# EAGLE design Power PCB_v10 (EAGLE 9.7.0)
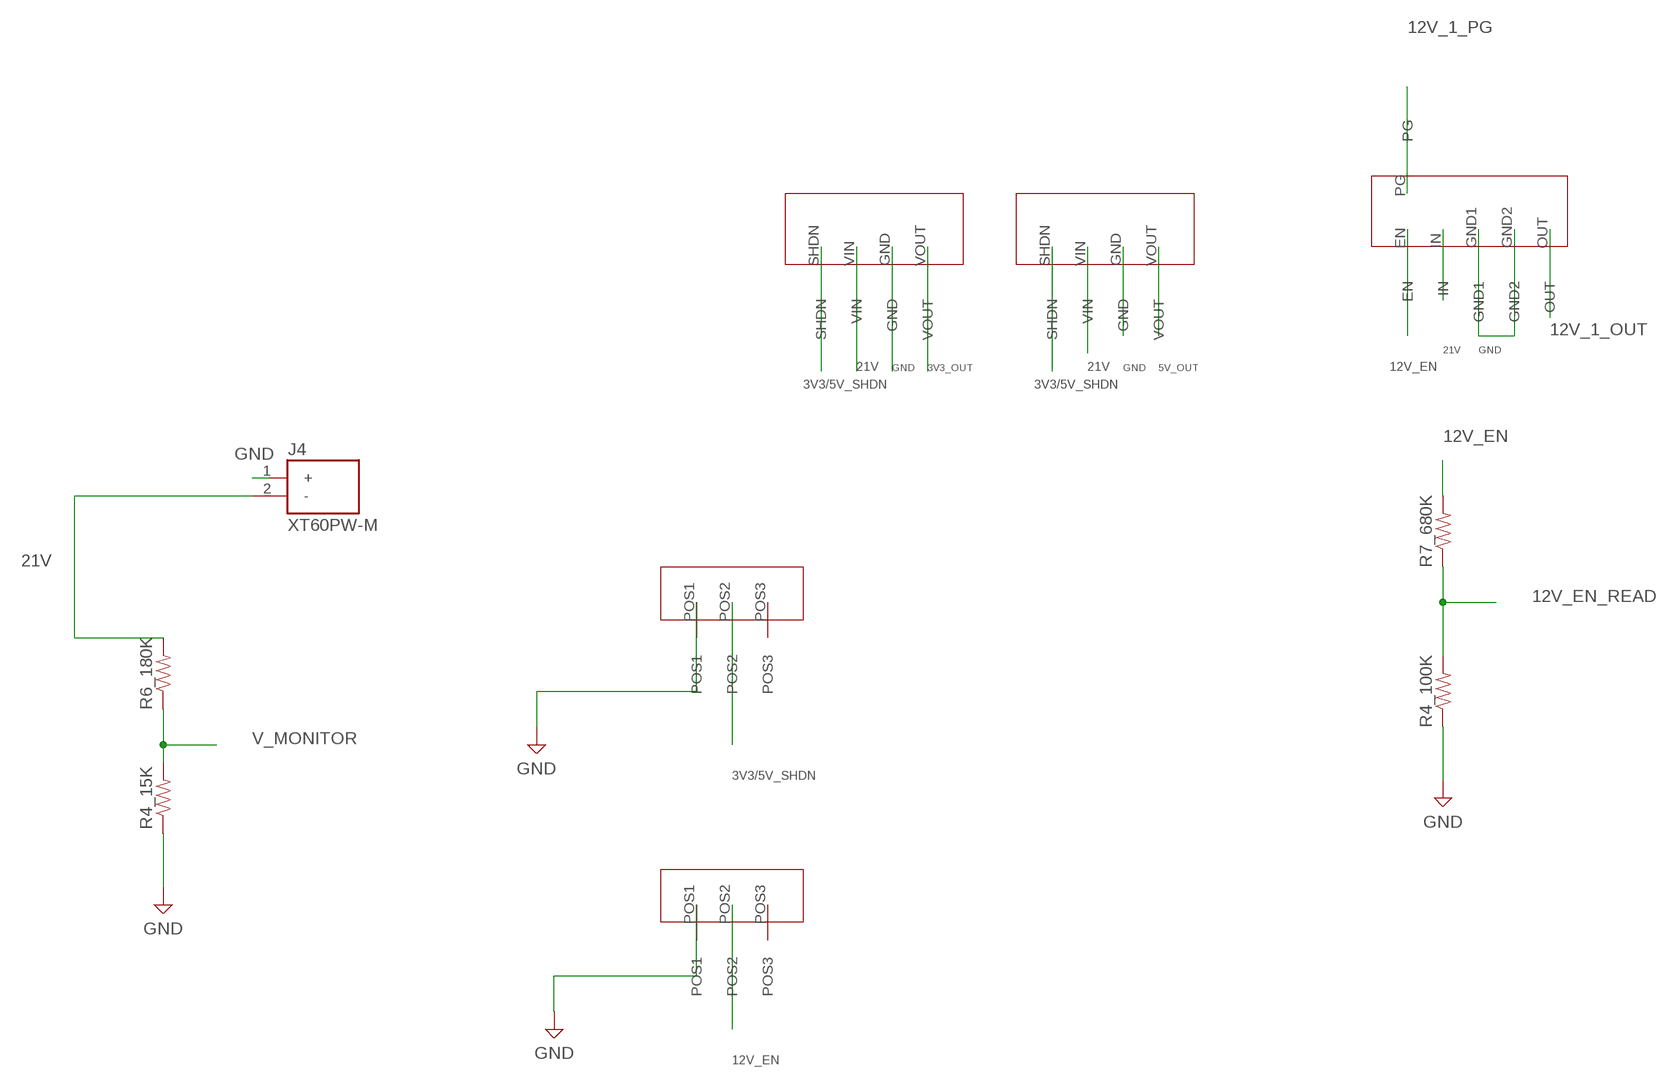
[diagram p0: schematic, sheet 1, part 1 of 2]
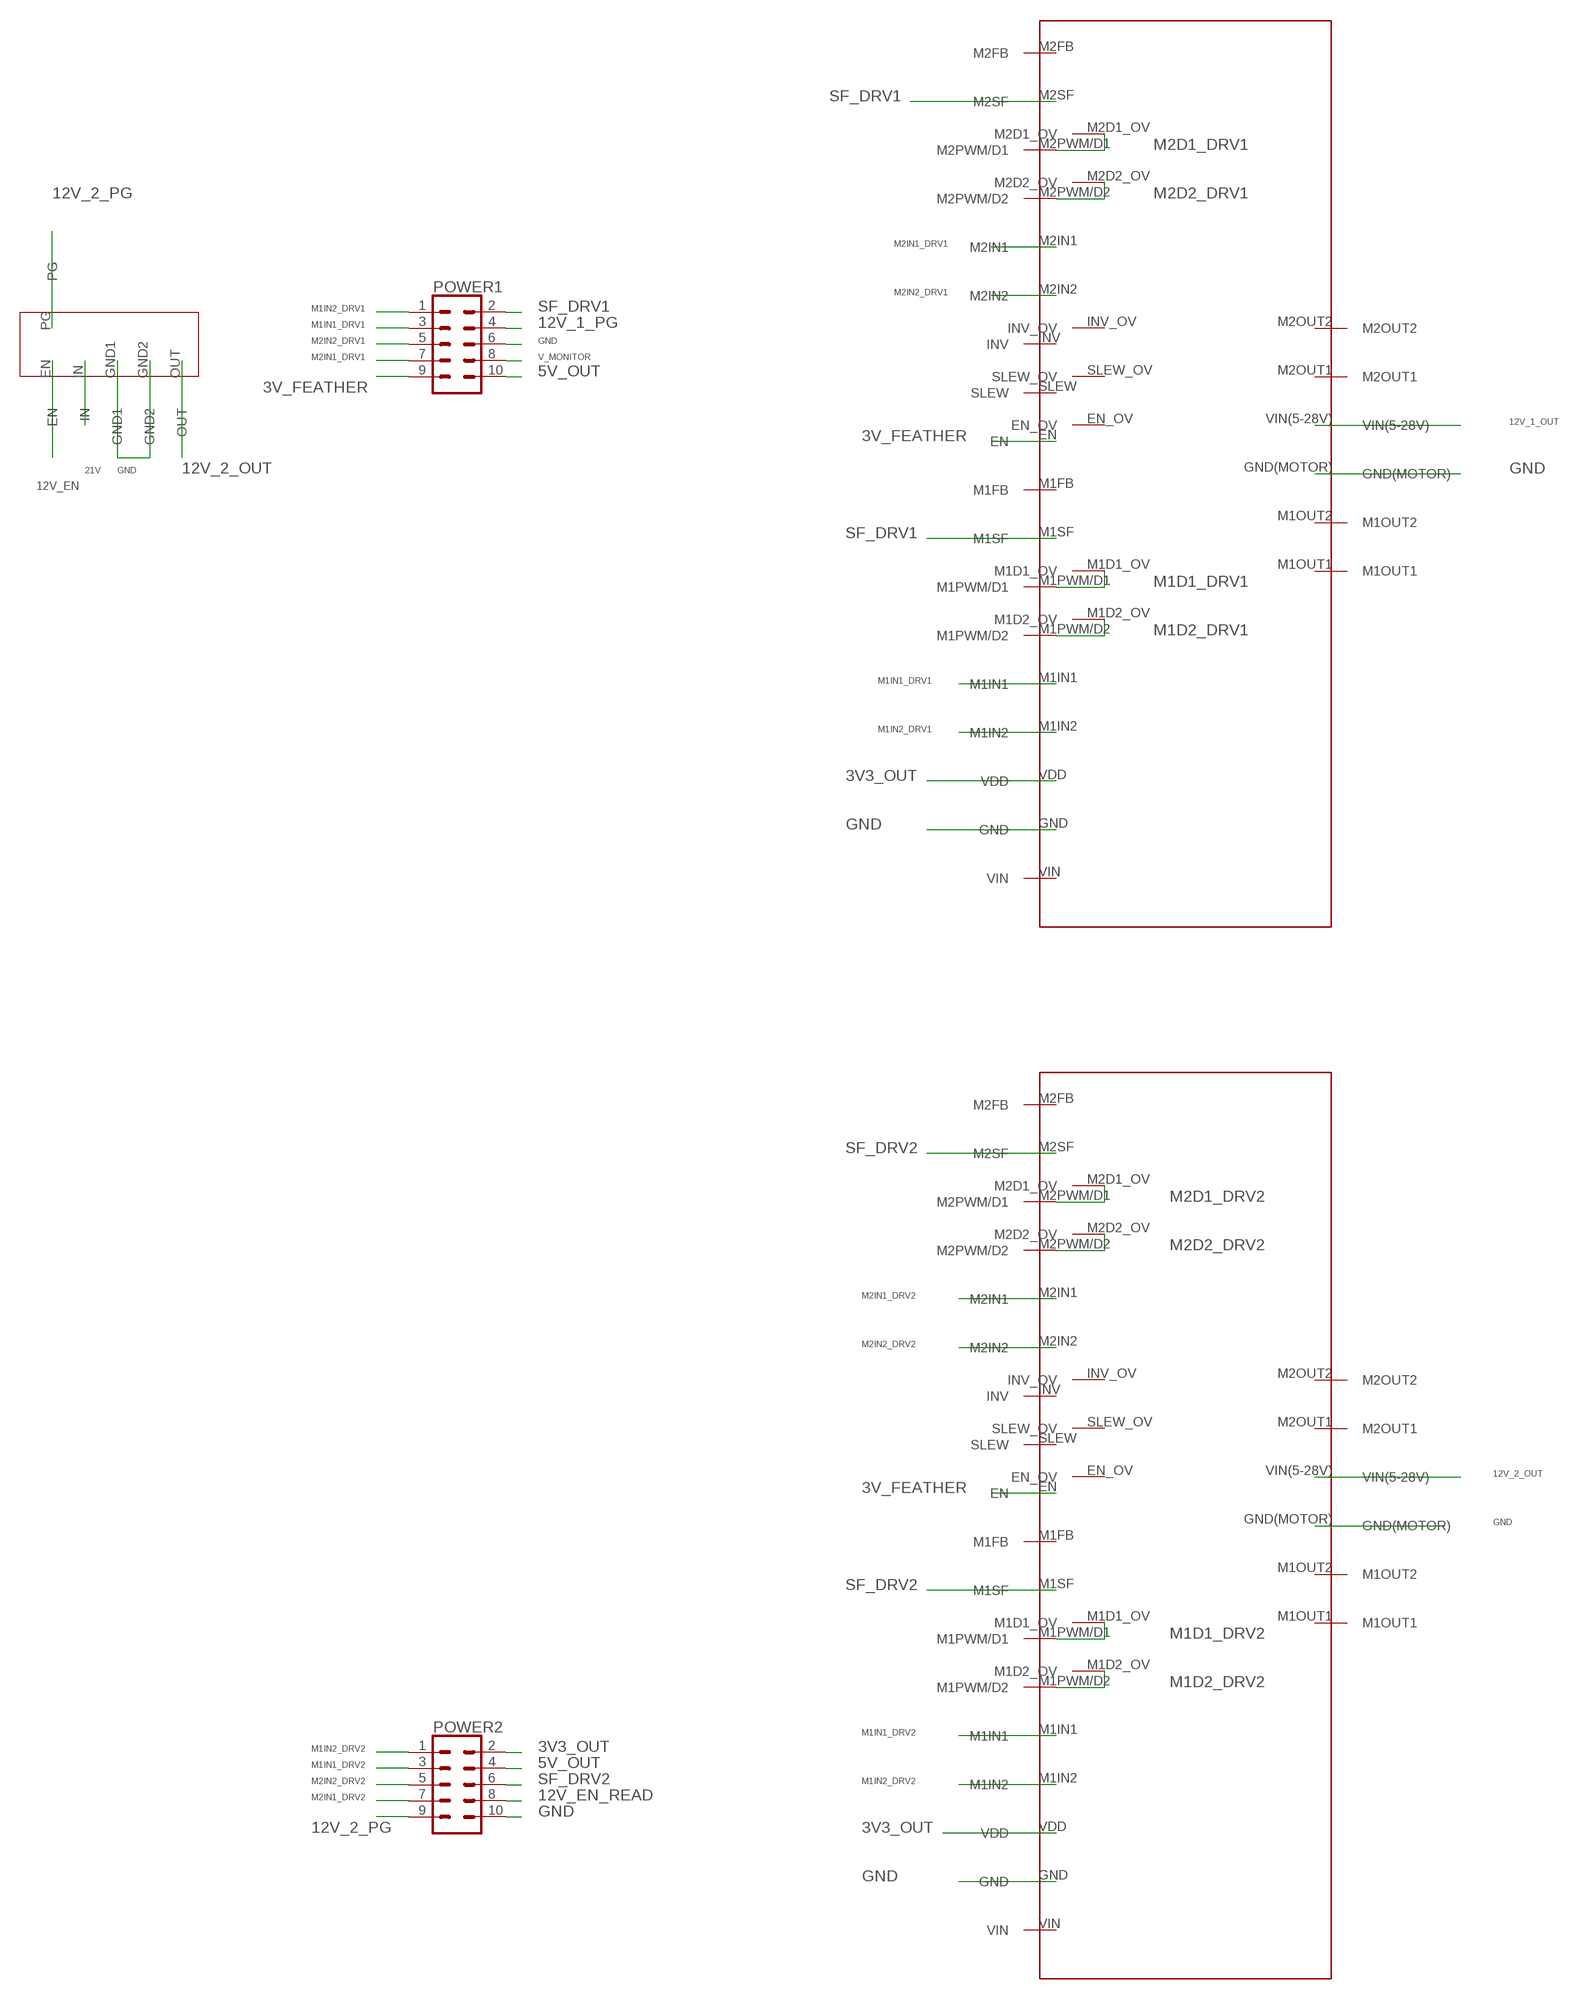
[diagram p1: schematic, sheet 1, part 2 of 2]

## Parts
J4  XT60PW-M  [AMASS_XT60PW-M]
POWER1  CONN_05X2SHD  [2X5-SHROUDED]
POWER2  CONN_05X2SHD  [2X5-SHROUDED]
R4_15K  RESISTORAXIAL-0.3  [AXIAL-0.3]
R4_100K  RESISTORAXIAL-0.3  [AXIAL-0.3]
R6_180K  RESISTORAXIAL-0.3  [AXIAL-0.3]
R7_680K  RESISTORAXIAL-0.3  [AXIAL-0.3]
U$1  CUSTOM_MOTORDRIVER  [CUSTOM_MOTORDRIVER]
U$2  CUSTOM_12V_REG  [CUSTOM_12V_REG]
U$3  CUSTOM_12V_REG  [CUSTOM_12V_REG]
U$4  CUSTOM_3.3/5V_REG  [CUSTOM_3.3/5V_REG]
U$5  CUSTOM_3.3/5V_REG  [CUSTOM_3.3/5V_REG]
U$6  CUSTOM_MOTORDRIVER  [CUSTOM_MOTORDRIVER]
U$7  CUSTOM_SWITCH  [CUSTOM_SWITCH]
U$8  CUSTOM_SWITCH  [CUSTOM_SWITCH]

## Nets
3V3/5V_SHDN: U$4.SHDN U$5.SHDN U$7.POS2
3V3_OUT: POWER2.2 U$1.VDD U$4.VOUT U$6.VDD
3V_FEATHER: POWER1.9 U$1.EN U$6.EN
5V_OUT: POWER1.10 POWER2.4 U$5.VOUT
12V_1_OUT: U$1.VIN(5-28V) U$3.OUT
12V_1_PG: POWER1.4 U$3.PG
12V_2_OUT: U$2.OUT U$6.VIN(5-28V)
12V_2_PG: POWER2.9 U$2.PG
12V_EN: R7_680K.P$2 U$2.EN U$3.EN U$8.POS2
12V_EN_READ: POWER2.8 R4_100K.P$2 R7_680K.P$1
21V: J4.2(-) R6_180K.P$2 U$2.IN U$3.IN U$4.VIN U$5.VIN
GND: J4.1(+) POWER1.6 POWER2.10 R4_15K.P$1 R4_100K.P$1 U$1.GND U$1.GND(MOTOR) U$2.GND1 U$2.GND2 U$3.GND1 U$3.GND2 U$4.GND U$5.GND U$6.GND U$6.GND(MOTOR) U$7.POS1 U$8.POS1
M1D1_DRV1: U$1.M1D1_OV U$1.M1PWM/D1
M1D1_DRV2: U$6.M1D1_OV U$6.M1PWM/D1
M1D2_DRV1: U$1.M1D2_OV U$1.M1PWM/D2
M1D2_DRV2: U$6.M1D2_OV U$6.M1PWM/D2
M1IN1_DRV1: POWER1.3 U$1.M1IN1
M1IN1_DRV2: POWER2.3 U$6.M1IN1
M1IN2_DRV1: POWER1.1 U$1.M1IN2
M1IN2_DRV2: POWER2.1 U$6.M1IN2
M2D1_DRV1: U$1.M2D1_OV U$1.M2PWM/D1
M2D1_DRV2: U$6.M2D1_OV U$6.M2PWM/D1
M2D2_DRV1: U$1.M2D2_OV U$1.M2PWM/D2
M2D2_DRV2: U$6.M2D2_OV U$6.M2PWM/D2
M2IN1_DRV1: POWER1.7 U$1.M2IN1
M2IN1_DRV2: POWER2.7 U$6.M2IN1
M2IN2_DRV1: POWER1.5 U$1.M2IN2
M2IN2_DRV2: POWER2.5 U$6.M2IN2
SF_DRV1: POWER1.2 U$1.M1SF U$1.M2SF
SF_DRV2: POWER2.6 U$6.M1SF U$6.M2SF
V_MONITOR: POWER1.8 R4_15K.P$2 R6_180K.P$1
Unconnected: U$1.EN_OV U$1.INV U$1.INV_OV U$1.M1FB U$1.M1OUT1 U$1.M1OUT2 U$1.M2FB U$1.M2OUT1 U$1.M2OUT2 U$1.SLEW U$1.SLEW_OV U$1.VIN U$6.EN_OV U$6.INV U$6.INV_OV U$6.M1FB U$6.M1OUT1 U$6.M1OUT2 U$6.M2FB U$6.M2OUT1 U$6.M2OUT2 U$6.SLEW U$6.SLEW_OV U$6.VIN U$7.POS3 U$8.POS3

## Library data of the parts
J4 = XT60PW-M:XT60PW-M: Check availability <https://pricing.snapeda.com/parts/XT60PW-M/AMASS/view-part?ref=eda>; AVAILABILITY: Not in stock; CHECK_PRICES: https://www.snapeda.com/parts/XT60PW-M/AMASS/view-part/?ref=eda; DESCRIPTION: Socket, DC supply, male, PIN: 2; MF: AMASS; MP: XT60PW-M; PACKAGE: Package; PRICE: None; SNAPEDA_LINK: https://www.snapeda.com/parts/XT60PW-M/AMASS/view-part/?ref=snap
POWER1 POWER2 = SparkFun-Connectors:CONN_05X2: Multi connection point. Often used as Generic Header-pin footprint for 0.1 inch spaced/style header connections For AVR SPI programming port, see special device with nice symbol: "AVR_SPI_PROG_5x2.dev" You can populate with any combo of single row headers, but if you'd like an exact match, check these: 2x5 AVR ICSP Male Header <https://www.sparkfun.com/products/778> (PRT-00778) 2x5 Pin Shrouded Header <https://www.sparkfun.com/products/8506> (PRT-08506) On any of the 0.1 inch spaced packages, you can populate with these: Break Away Headers - Straight <https://www.sparkfun.com/products/116> (PRT-00116) Break Away Male Headers - Right Angle <https://www.sparkfun.com/products/553> (PRT-00553) Female Headers <https://www.sparkfun.com/products/115> (PRT-00115) Break Away Headers - Machine Pin <https://www.sparkfun.com/products/117> (PRT-00117) Break Away Female Headers - Swiss Machine Pin <https://www.sparkfun.com/products/743> (PRT-00743) Special note: the shrouded connector mates well with our 5x2 ribbon cables: 2x5 Pin IDC Ribbon Cable <https://www.sparkfun.com/products/8535> (PRT-08535); PROD_ID: CONN-08671; SF_ID: PRT-08506
R4_15K R4_100K R6_180K R7_680K = SparkFun-Resistors:RESISTOR: Generic Resistor Package
U$1 U$6 = Custom_MotorDriver:CUSTOM_MOTORDRIVER
U$2 U$3 = Footprint Complete:CUSTOM_12V_REG
U$4 U$5 = Custom_3.3/5V_Reg:CUSTOM_3.3/5V_REG
U$7 U$8 = Custom_Switch:CUSTOM_SWITCH

## Board
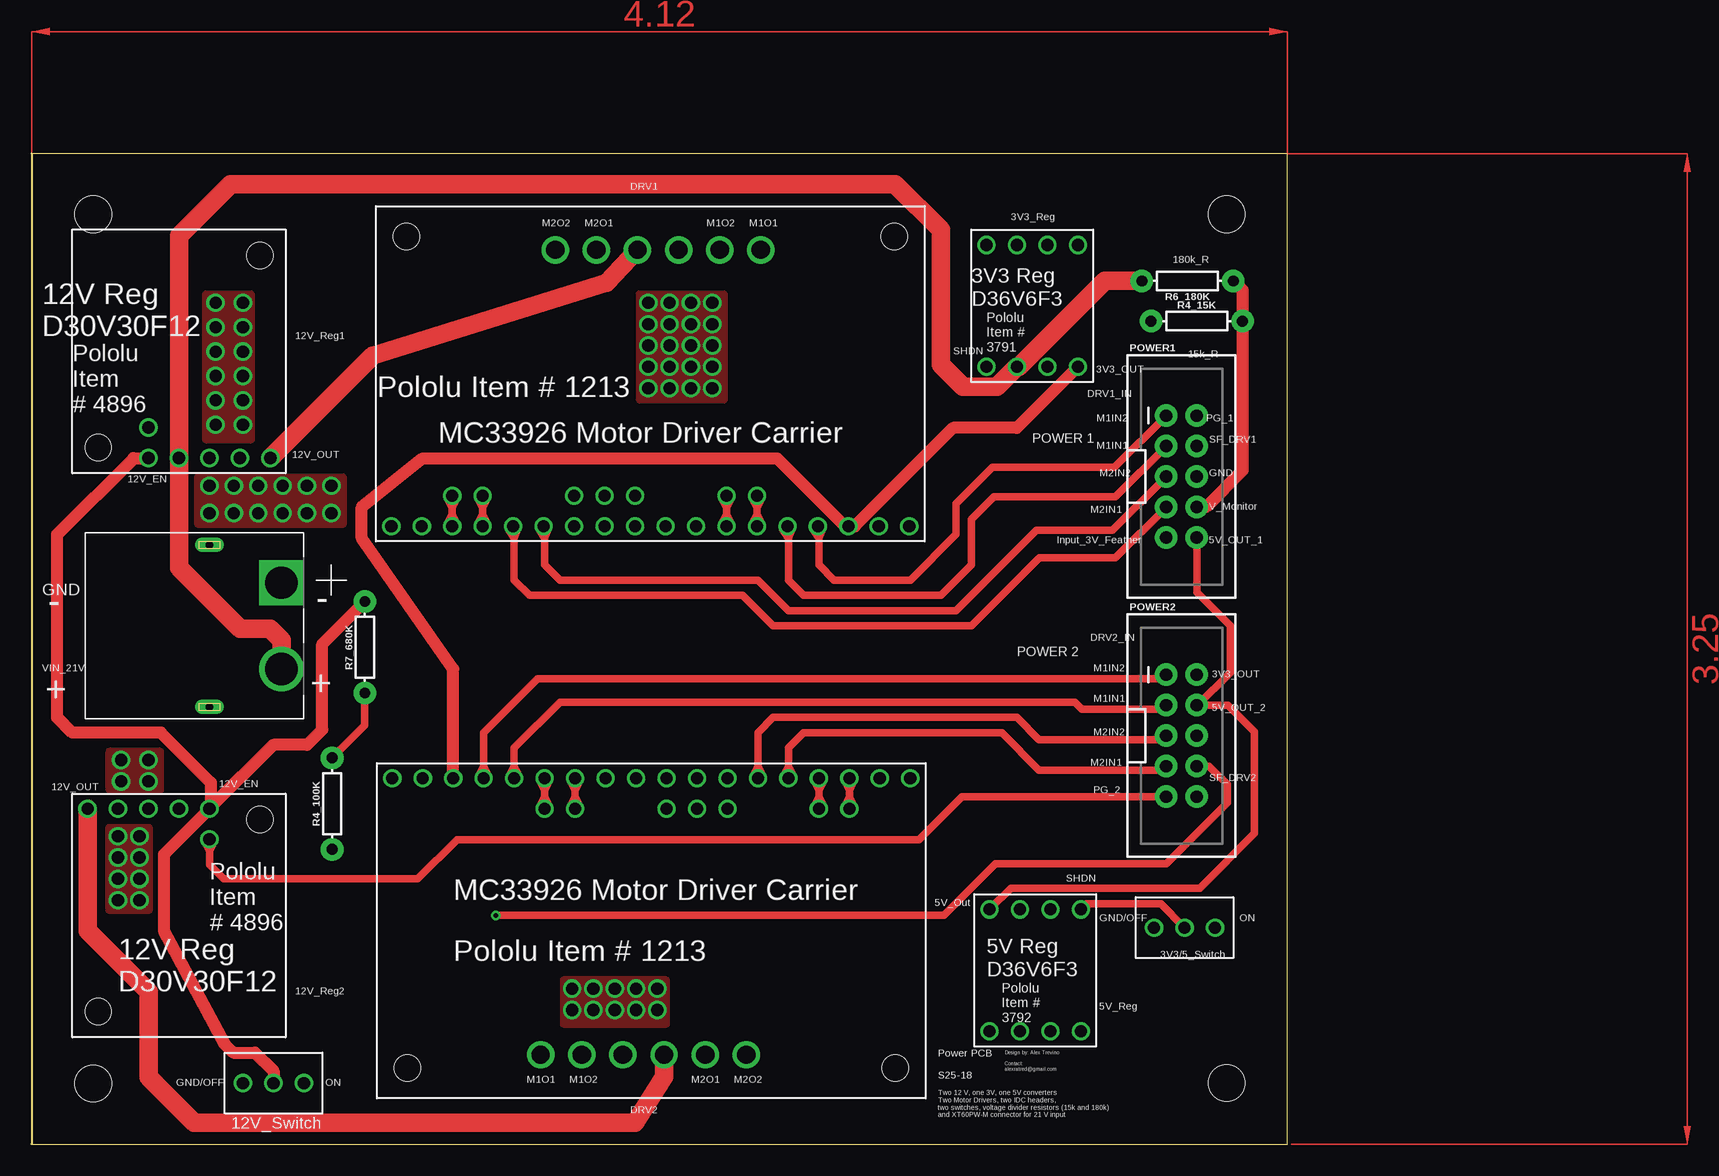
[diagram p2: board, top side]
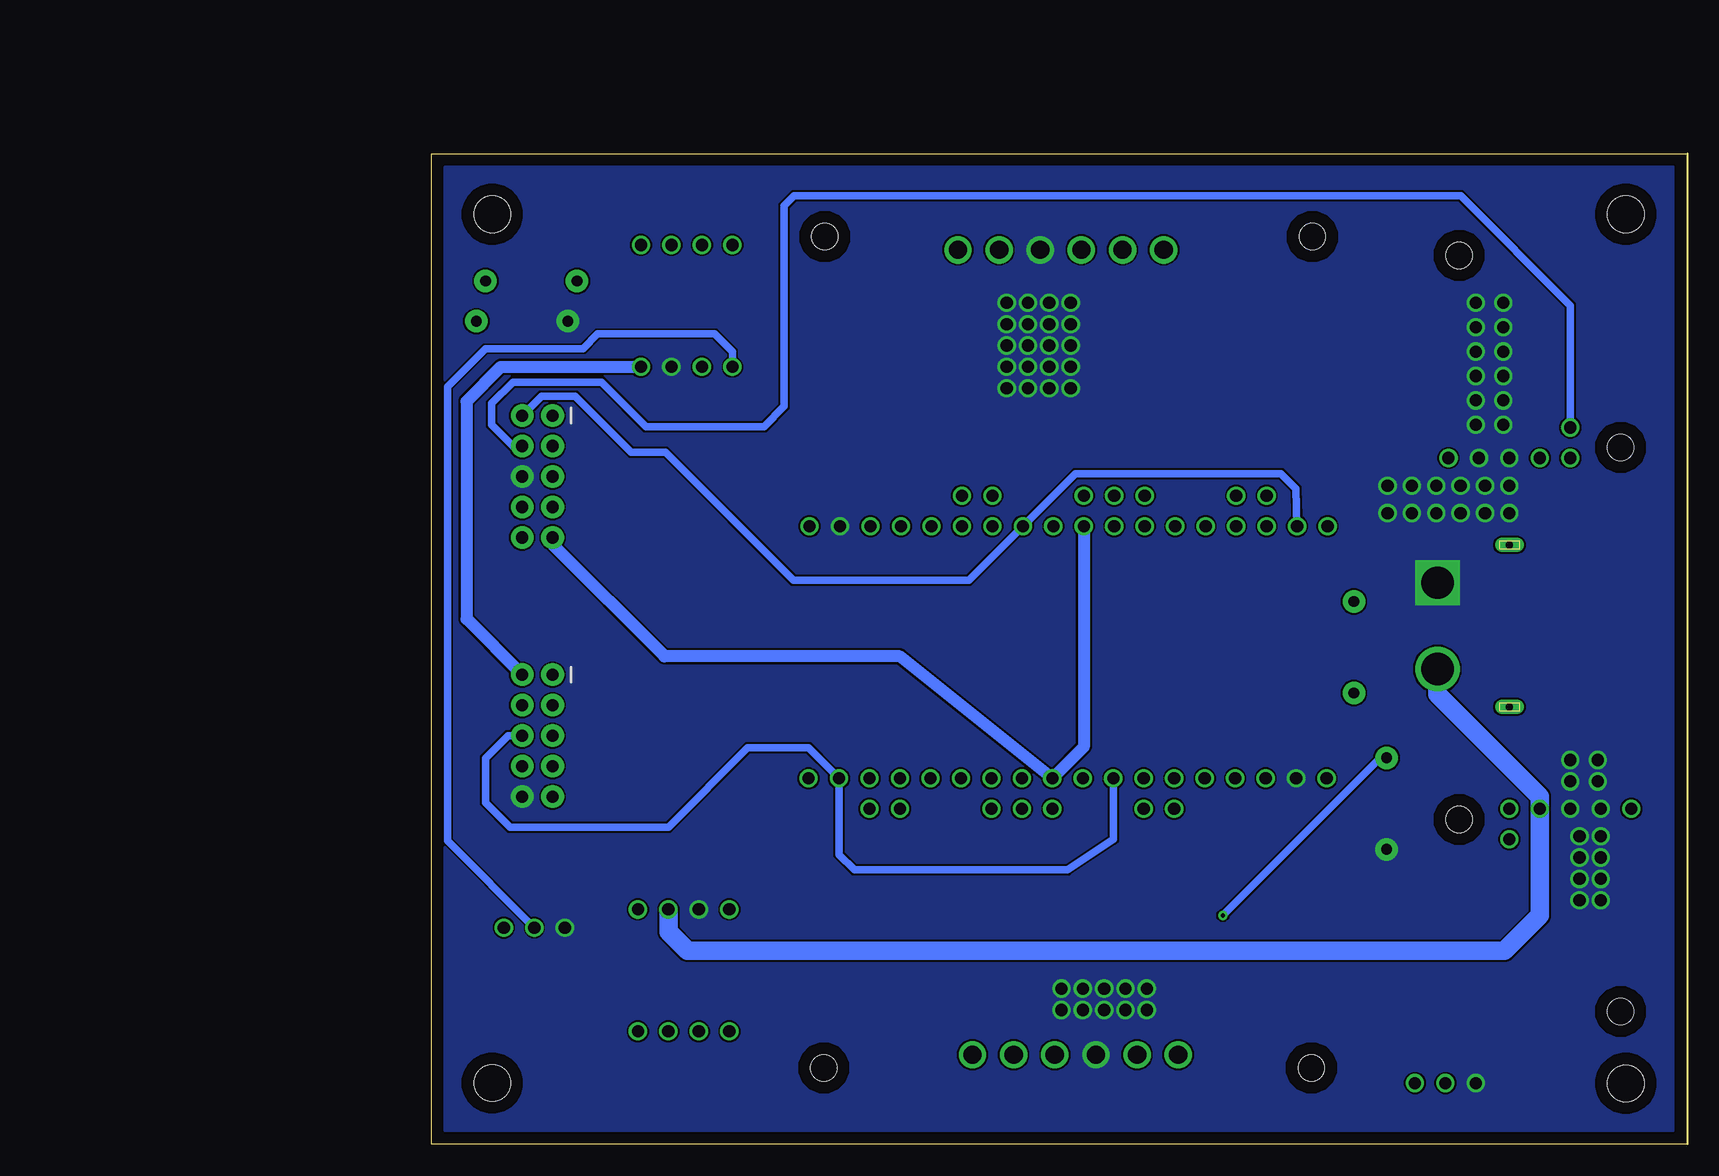
[diagram p3: board, bottom side, seen from below]

Size 104.67 x 82.54 mm. Coordinates in mm from the lower left corner, seen from the top.
Outline: 0,0 104.67,0 104.67,82.54 0,82.54 0,0
Copper layers (1*16): Top / Bottom
Stack-up Default Layer Stack: Top User Defined 0.035mm / Dielectric-1 User Defined 1.5mm / Bottom User Defined 0.035mm
Design rules: minimum copper width 6mil, minimum drill size 0.35mm, copper clearance wire_polygon to wire_polygon 6mil, copper clearance wire_polygon to pad_smd 6mil, copper clearance wire_polygon to via 6mil, copper clearance pad_smd to pad_smd 6mil, copper clearance pad_smd to via 6mil, copper clearance via to via 6mil, copper clearance smd to pad (same net) 6mil, copper clearance smd to via (same net) 6mil, copper clearance smd to smd (same net) 6mil, dimension clearance 40mil, via restrict clearance 0mil, restrict clearance 0mil, drill distance 6mil, keepout clearance 0mil
Holes 3.05 mm at 99.61,77.48 5.13,77.48 5.13,5.06 99.61,5.09

### Footprints (pad centres in the part's own frame; a part is rotated, then mirrored left to right if it is on the bottom)
AMASS_XT60PW-M = drill 2.7 square: 1 3.6,-6 | drill 2.7: 2 -3.6,-6 | drill 0.6 pad 1.2 long: S1 6.75,0; S2 -6.75,0
2X5-SHROUDED = drill 1.016 pad 1.88: 1 -1.27,5.08; 2 1.27,5.08; 3 -1.27,2.54; 4 1.27,2.54; 5 -1.27,0; 6 1.27,0; 7 -1.27,-2.54; 8 1.27,-2.54; 9 -1.27,-5.08; 10 1.27,-5.08
AXIAL-0.3 = drill 0.9 pad 1.88: P$1 -3.81,0; P$2 3.81,0
CUSTOM_MOTORDRIVER = drill 1.016: EN 21.59,1.27; EN_OV 21.59,3.81; GND 41.91,1.27; INV 16.51,1.27; INV_OV 16.51,3.81; M1D1_OV 29.21,3.81; M1D2_OV 31.75,3.81; M1FB 24.13,1.27; M1IN1 34.29,1.27; M1IN2 36.83,1.27; M1PWM/D1 29.21,1.27; M1PWM/D2 31.75,1.27; M1SF 26.67,1.27; M2D1_OV 6.35,3.81; M2D2_OV 8.89,3.81; M2FB 1.27,1.27; M2IN1 11.43,1.27; M2IN2 13.97,1.27; M2PWM/D1 6.35,1.27; M2PWM/D2 8.89,1.27; M2SF 3.81,1.27; SLEW 19.05,1.27; SLEW_OV 19.05,3.81; VDD 39.37,1.27; VIN 44.45,1.27 | drill 1.524: GND(MOTOR) 25.222,24.308; M1OUT1 32.08,24.308; M1OUT2 28.651,24.308; M2OUT1 18.364,24.308; M2OUT2 14.935,24.308; VIN(5-28V) 21.793,24.308 | hole 2.184: 2.54,25.4; 43.18,25.4
CUSTOM_12V_REG = drill 1.016: EN 6.35,1.27; GND1 11.43,1.27; GND2 13.97,1.27; IN 8.89,1.27; OUT 16.51,1.27; PG 6.35,3.81 | hole 2.184: 2.159,2.159; 15.621,18.161
CUSTOM_3.3/5V_REG = drill 1.016: GND 6.35,1.27; SHDN 1.27,1.27; STND_1 1.27,11.43; STND_2 3.81,11.43; STND_3 6.35,11.43; STND_4 8.89,11.43; VIN 3.81,1.27; VOUT 8.89,1.27
CUSTOM_SWITCH = drill 1.016: POS1 1.524,2.54; POS2 4.064,2.54; POS3 6.604,2.54

### Placement (x,y rotation side)
J4  14.83,43.18 90 top
POWER1  95.86,55.63 0 top
POWER2  95.86,34.04 0 top
R4_15K  97.13,68.58 0 top
R4_100K  25.06,28.37 90 top
R6_180K  96.36,71.93 180 top
R7_680K  27.78,41.4 90 top
U$1  28.72,50.22 0 top
U$2  21.18,29.21 180 top
U$3  3.4,55.9 0 top
U$4  78.33,63.5 0 top
U$5  88.74,20.83 180 top
U$6  74.52,31.75 180 top
U$7  92.05,15.49 0 top
U$8  16.1,2.54 0 top

### Tracks (layer width: path | path; a pad name or v marks a point on that pad's centre or on a via)
3V3/5V_SHDN
  Top 0.61: U$5.SHDN 87.93,20.02 94.13,20.02 U$7.POS2
  Bottom 0.61: U$4.SHDN 79.6,66.04 81.08,67.52 90.82,67.52 92.05,66.29 100.17,66.29 103.35,63.12 103.35,25.27 U$7.POS2
3V3_OUT
  Top 1.016: U$4.VOUT 82.14,59.69 76.82,59.69 68.62,51.49 U$1.VDD 67.81,51.49 62.14,57.15 32.61,57.15 27.53,53.09 27.53,50.47 35.15,39.59 U$6.VDD
  Bottom 1.016: U$4.VOUT 98.9,64.77 101.77,61.9 101.77,43.76 POWER2.2
3V_FEATHER
  Bottom 1.016: U$1.EN 50.31,33.1 U$6.EN 65.63,40.64 85.26,40.64 94.59,49.96 POWER1.9
5V_OUT
  Top 0.61: POWER1.10 97.13,45.97 99.92,43.18 99.92,39.29 97.2,36.58 | 97.2,36.58 POWER2.4 | 97.2,36.58 99.72,36.58 101.95,34.34 101.95,25.91 97.38,21.34 81.63,21.34 U$5.VOUT
12V_1_OUT
  Top 1.524: U$3.OUT 28.44,65.7 47.95,71.77 U$1.VIN(5-28V)
12V_1_PG
  Bottom 0.61: U$3.PG 9.75,69.87 18.89,79.02 74.45,79.02 75.28,78.18 75.28,61.47 76.96,59.79 86.81,59.79 90.52,63.5 97.89,63.5 99.67,61.72 99.67,59.94 97.89,58.17 POWER1.4
12V_2_OUT
  Top 1.524: U$2.OUT 4.67,17.78 9.75,12.7 9.75,5.59 13.56,1.78 50.3,1.78 52.73,5.59 U$6.VIN(5-28V)
12V_2_PG
  Top 0.61: U$2.PG 14.83,24.38 | 14.83,24.38 14.83,23.3 16.03,22.09 32.2,22.09 35.47,25.37 73.98,25.37 77.57,28.96 POWER2.9 | 14.83,24.38 15.24,25.19 | 15.24,25.19 | U$2.PG 15.24,25.19 | 14.83,24.38 14.42,25.19 | U$2.PG 14.42,25.19 | 14.83,24.38 15.24,25.19 | U$2.PG 15.24,25.19 | 14.83,24.38 14.42,25.19 | U$2.PG 14.42,25.19
12V_EN
  Top 1.016: U$3.EN 8.5,57.17 2.13,50.8 2.13,35.56 3.4,34.29 10.78,34.29 14.94,30.13 14.94,28.05 | R7_680K.P$2 24.23,41.66 24.23,34.54 22.96,33.27 20.16,33.27 14.94,28.05 | 14.94,28.05 U$2.EN 11.02,24.13 11.02,17.78 16.1,8.33 16.81,7.62 18.64,7.62 20.16,6.1 U$8.POS2
12V_EN_READ  (via drill 0.35)
  Top 0.61: R4_100K.P$2 27.78,34.91 R7_680K.P$1 | POWER2.8 98.14,31.5 99.67,29.97 99.67,28.45 94.59,23.37 80.36,23.37 76.04,19.05 v38.71,19.05
  Bottom 0.61: v38.71,19.05 25.57,32.18 R4_100K.P$2
21V
  Top 1.524: R6_180K.P$2 89.47,71.93 82.31,64.77 U$4.VIN 80.46,63.09 77.64,63.09 75.79,64.94 75.79,76.2 71.99,80 16.61,80 12.29,75.68 U$3.IN 12.29,48.03 17.39,42.93 19.91,42.93 20.83,42.01 J4.2
  Bottom 1.524: U$5.VIN 84.93,17.7 83.34,16.1 15.24,16.1 12.29,19.05 U$2.IN 12.29,28.96 20.83,37.5 J4.2
GND  (via drill 1.02)
  other vias: 15.34,70.1 17.62,70.1 15.34,68.07 17.62,68.07 15.34,66.04 17.62,66.04 15.34,64.01 17.62,64.01 15.34,61.98 17.62,61.98 15.34,59.94 17.62,59.94 51.41,70.1 53.18,70.1 54.96,70.1 56.74,70.1 51.41,68.33 53.18,68.33 54.96,68.33 56.74,68.33 51.41,66.55 53.18,66.55 54.96,66.55 56.74,66.55 51.41,64.77 53.18,64.77 54.96,64.77 56.74,64.77 51.41,62.99 53.18,62.99 54.96,62.99 56.74,62.99 7.46,32 9.75,32 9.75,30.23 7.46,30.23 7.21,25.65 8.99,25.65 7.21,23.88 8.99,23.88 7.21,22.1 8.99,22.1 7.21,20.32 8.99,20.32 45.06,12.95 46.83,12.95 48.61,12.95 50.39,12.95 52.17,12.95 45.06,11.18 46.83,11.18 48.61,11.18 50.39,11.18 52.17,11.18 14.83,54.86 16.86,54.86 18.89,54.86 20.93,54.86 22.96,54.86 24.99,54.86 14.83,52.58 16.86,52.58 18.89,52.58 20.93,52.58 22.96,52.58 24.99,52.58
  pour Bottom (no thermals): -1.68,85.09 106.27,85.09 106.27,-2.54 -1.68,-2.54
  pour Top: 13.56,55.88 26.26,55.88 26.26,51.37 13.56,51.37
  pour Top: 14.23,71.12 18.6,71.12 18.6,58.42 14.23,58.42
  pour Top: 50.39,71.12 58.01,71.12 58.01,61.72 50.39,61.72
  pour Top: 6.17,26.67 10.09,26.67 10.09,19.21 6.17,19.21
  pour Top: 44.04,13.97 53.18,13.97 53.18,9.71 44.04,9.71
  pour Top: 6.19,33.02 11.02,33.02 11.02,29.21 6.19,29.21
M1D1_DRV1
  Top 0.61: U$1.M1D1_OV 57.93,53.01 | 57.93,53.01 57.93,52.5 | 57.93,52.5 U$1.M1PWM/D1 | 57.93,52.5 | 57.93,52.5 | 57.93,52.5 58.34,51.69 | 57.93,52.5 57.52,51.69 | 57.52,51.69 | U$1.M1PWM/D1 57.52,51.69 | 57.93,52.5 58.34,51.69 | U$1.M1PWM/D1 58.34,51.69 | 57.93,52.5 57.52,51.69 | U$1.M1PWM/D1 57.52,51.69 | 57.93,52.5 58.34,51.69 | U$1.M1PWM/D1 58.34,51.69 | 57.93,53.01 58.34,53.82 | 58.34,53.82 | U$1.M1D1_OV 58.34,53.82 | 57.93,53.01 57.52,53.82 | U$1.M1D1_OV 57.52,53.82 | 57.93,53.01 58.34,53.82 | U$1.M1D1_OV 58.34,53.82 | 57.93,53.01 57.52,53.82 | U$1.M1D1_OV 57.52,53.82
M1D1_DRV2
  Top 0.61: U$6.M1PWM/D1 45.31,29.46 | 45.31,29.46 45.31,28.96 | 45.31,28.96 U$6.M1D1_OV | 45.31,29.46 45.72,30.27 | 45.72,30.27 | U$6.M1PWM/D1 45.72,30.27 | 45.31,29.46 44.9,30.27 | U$6.M1PWM/D1 44.9,30.27 | 45.31,29.46 45.72,30.27 | U$6.M1PWM/D1 45.72,30.27 | 45.31,29.46 44.9,30.27 | U$6.M1PWM/D1 44.9,30.27 | 45.31,28.96 | 45.31,28.96 | 45.31,28.96 45.72,28.15 | 45.31,28.96 44.9,28.15 | 44.9,28.15 | U$6.M1D1_OV 44.9,28.15 | 45.31,28.96 45.72,28.15 | U$6.M1D1_OV 45.72,28.15 | 45.31,28.96 44.9,28.15 | U$6.M1D1_OV 44.9,28.15 | 45.31,28.96 45.72,28.15 | U$6.M1D1_OV 45.72,28.15
M1D2_DRV1
  Top 0.61: U$1.M1D2_OV 60.47,53.01 | 60.47,53.01 60.47,52.5 | 60.47,52.5 U$1.M1PWM/D2 | 60.47,52.5 | 60.47,52.5 | 60.47,52.5 60.88,51.69 | 60.47,52.5 60.06,51.69 | 60.06,51.69 | U$1.M1PWM/D2 60.06,51.69 | 60.47,52.5 60.88,51.69 | U$1.M1PWM/D2 60.88,51.69 | 60.47,52.5 60.06,51.69 | U$1.M1PWM/D2 60.06,51.69 | 60.47,52.5 60.88,51.69 | U$1.M1PWM/D2 60.88,51.69 | 60.47,53.01 60.88,53.82 | 60.88,53.82 | U$1.M1D2_OV 60.88,53.82 | 60.47,53.01 60.06,53.82 | U$1.M1D2_OV 60.06,53.82 | 60.47,53.01 60.88,53.82 | U$1.M1D2_OV 60.88,53.82 | 60.47,53.01 60.06,53.82 | U$1.M1D2_OV 60.06,53.82
M1D2_DRV2
  Top 0.61: U$6.M1PWM/D2 42.77,29.46 | 42.77,29.46 42.77,28.96 | 42.77,28.96 U$6.M1D2_OV | 42.77,29.46 43.18,30.27 | 43.18,30.27 | U$6.M1PWM/D2 43.18,30.27 | 42.77,29.46 42.36,30.27 | U$6.M1PWM/D2 42.36,30.27 | 42.77,29.46 43.18,30.27 | U$6.M1PWM/D2 43.18,30.27 | 42.77,29.46 42.36,30.27 | U$6.M1PWM/D2 42.36,30.27 | 42.77,28.96 | 42.77,28.96 | 42.77,28.96 43.18,28.15 | 42.77,28.96 42.36,28.15 | 42.36,28.15 | U$6.M1D2_OV 42.36,28.15 | 42.77,28.96 43.18,28.15 | U$6.M1D2_OV 43.18,28.15 | 42.77,28.96 42.36,28.15 | U$6.M1D2_OV 42.36,28.15 | 42.77,28.96 43.18,28.15 | U$6.M1D2_OV 43.18,28.15
M1IN1_DRV1
  Top 0.61: U$1.M1IN1 63.09,51.4 63.09,50.47 | 63.09,50.47 63.09,46.99 64.36,45.72 75.79,45.72 78.33,48.26 78.33,52.07 80.2,53.94 90.36,53.94 POWER1.3 | 63.09,50.47 63.43,51.31 U$1.M1IN1 | 63.09,50.47 62.62,51.25 U$1.M1IN1
M1IN1_DRV2
  Top 0.61: U$6.M1IN1 40.23,31.5 | 40.23,31.5 40.23,33.02 44.04,36.83 86.97,36.83 87.55,36.25 94.26,36.25 POWER2.3 | 40.23,31.5 | 40.23,31.5 | 40.23,31.5 40.64,30.69 | 40.23,31.5 39.82,30.69 | 39.82,30.69 | U$6.M1IN1 39.82,30.69 | 40.23,31.5 40.64,30.69 | U$6.M1IN1 40.64,30.69 | 40.23,31.5 39.82,30.69 | U$6.M1IN1 39.82,30.69 | 40.23,31.5 40.64,30.69 | U$6.M1IN1 40.64,30.69
M1IN2_DRV1
  Top 0.61: U$1.M1IN2 65.63,51.4 65.63,50.47 | 65.63,50.47 65.63,48.26 66.9,46.99 73.25,46.99 77.06,50.8 77.06,53.34 80.11,56.39 90.27,56.39 POWER1.1 | 65.63,50.47 65.97,51.31 U$1.M1IN2 | 65.63,50.47 65.16,51.25 U$1.M1IN2
M1IN2_DRV2
  Top 0.61: 37.69,31.5 37.69,34.29 42.19,38.79 94.26,38.79 POWER2.1 | 37.69,31.5 U$6.M1IN2 | 37.69,31.5 | 37.69,31.5 | 37.69,31.5 38.1,30.69 | 37.69,31.5 37.28,30.69 | 37.28,30.69 | U$6.M1IN2 37.28,30.69 | 37.69,31.5 38.1,30.69 | U$6.M1IN2 38.1,30.69 | 37.69,31.5 37.28,30.69 | U$6.M1IN2 37.28,30.69 | 37.69,31.5 38.1,30.69 | U$6.M1IN2 38.1,30.69
M2D1_DRV1
  Top 0.61: U$1.M2D1_OV 35.07,53.01 | 35.07,53.01 35.07,52.5 | 35.07,52.5 U$1.M2PWM/D1 | 35.07,52.5 | 35.07,52.5 | 35.07,52.5 35.48,51.69 | 35.07,52.5 34.66,51.69 | 34.66,51.69 | U$1.M2PWM/D1 34.66,51.69 | 35.07,52.5 35.48,51.69 | U$1.M2PWM/D1 35.48,51.69 | 35.07,52.5 34.66,51.69 | U$1.M2PWM/D1 34.66,51.69 | 35.07,52.5 35.48,51.69 | U$1.M2PWM/D1 35.48,51.69 | 35.07,53.01 35.48,53.82 | 35.48,53.82 | U$1.M2D1_OV 35.48,53.82 | 35.07,53.01 34.66,53.82 | U$1.M2D1_OV 34.66,53.82 | 35.07,53.01 35.48,53.82 | U$1.M2D1_OV 35.48,53.82 | 35.07,53.01 34.66,53.82 | U$1.M2D1_OV 34.66,53.82
M2D1_DRV2
  Top 0.61: U$6.M2PWM/D1 68.17,29.46 | 68.17,29.46 68.17,28.96 | 68.17,28.96 U$6.M2D1_OV | 68.17,29.46 68.58,30.27 | 68.58,30.27 | U$6.M2PWM/D1 68.58,30.27 | 68.17,29.46 67.76,30.27 | U$6.M2PWM/D1 67.76,30.27 | 68.17,29.46 68.58,30.27 | U$6.M2PWM/D1 68.58,30.27 | 68.17,29.46 67.76,30.27 | U$6.M2PWM/D1 67.76,30.27 | 68.17,28.96 | 68.17,28.96 | 68.17,28.96 68.58,28.15 | 68.17,28.96 67.76,28.15 | 67.76,28.15 | U$6.M2D1_OV 67.76,28.15 | 68.17,28.96 68.58,28.15 | U$6.M2D1_OV 68.58,28.15 | 68.17,28.96 67.76,28.15 | U$6.M2D1_OV 67.76,28.15 | 68.17,28.96 68.58,28.15 | U$6.M2D1_OV 68.58,28.15
M2D2_DRV1
  Top 0.61: U$1.M2D2_OV 37.61,53.01 | 37.61,53.01 37.61,52.5 | 37.61,52.5 U$1.M2PWM/D2 | 37.61,52.5 | 37.61,52.5 | 37.61,52.5 38.02,51.69 | 37.61,52.5 37.2,51.69 | 37.2,51.69 | U$1.M2PWM/D2 37.2,51.69 | 37.61,52.5 38.02,51.69 | U$1.M2PWM/D2 38.02,51.69 | 37.61,52.5 37.2,51.69 | U$1.M2PWM/D2 37.2,51.69 | 37.61,52.5 38.02,51.69 | U$1.M2PWM/D2 38.02,51.69 | 37.61,53.01 38.02,53.82 | 38.02,53.82 | U$1.M2D2_OV 38.02,53.82 | 37.61,53.01 37.2,53.82 | U$1.M2D2_OV 37.2,53.82 | 37.61,53.01 38.02,53.82 | U$1.M2D2_OV 38.02,53.82 | 37.61,53.01 37.2,53.82 | U$1.M2D2_OV 37.2,53.82
M2D2_DRV2
  Top 0.61: U$6.M2PWM/D2 65.63,29.46 | 65.63,29.46 65.63,28.96 | 65.63,28.96 U$6.M2D2_OV | 65.63,29.46 66.04,30.27 | 66.04,30.27 | U$6.M2PWM/D2 66.04,30.27 | 65.63,29.46 65.22,30.27 | U$6.M2PWM/D2 65.22,30.27 | 65.63,29.46 66.04,30.27 | U$6.M2PWM/D2 66.04,30.27 | 65.63,29.46 65.22,30.27 | U$6.M2PWM/D2 65.22,30.27 | 65.63,28.96 | 65.63,28.96 | 65.63,28.96 66.04,28.15 | 65.63,28.96 65.22,28.15 | 65.22,28.15 | U$6.M2D2_OV 65.22,28.15 | 65.63,28.96 66.04,28.15 | U$6.M2D2_OV 66.04,28.15 | 65.63,28.96 65.22,28.15 | U$6.M2D2_OV 65.22,28.15 | 65.63,28.96 66.04,28.15 | U$6.M2D2_OV 66.04,28.15
M2IN1_DRV1
  Top 0.61: U$1.M2IN1 40.23,51.4 40.23,50.47 | 40.23,50.47 40.23,46.99 41.5,45.72 59.28,45.72 61.82,43.18 78.33,43.18 84.01,48.86 90.36,48.86 POWER1.7 | 40.23,50.47 40.57,51.31 U$1.M2IN1 | 40.23,50.47 39.76,51.25 U$1.M2IN1
M2IN1_DRV2
  Top 0.61: U$6.M2IN1 63.09,31.5 | 63.09,31.5 63.09,33.02 64.36,34.29 80.87,34.29 83.99,31.17 94.26,31.17 POWER2.7 | 63.09,31.5 | 63.09,31.5 | 63.09,31.5 63.5,30.69 | 63.09,31.5 62.68,30.69 | 62.68,30.69 | U$6.M2IN1 62.68,30.69 | 63.09,31.5 63.5,30.69 | U$6.M2IN1 63.5,30.69 | 63.09,31.5 62.68,30.69 | U$6.M2IN1 62.68,30.69 | 63.09,31.5 63.5,30.69 | U$6.M2IN1 63.5,30.69
M2IN2_DRV1
  Top 0.61: U$1.M2IN2 42.77,51.4 42.77,50.47 | 42.77,50.47 42.77,48.26 44.04,46.99 60.55,46.99 63.09,44.45 77.06,44.45 83.76,51.15 90.11,51.15 POWER1.5 | 42.77,50.47 43.11,51.31 U$1.M2IN2 | 42.77,50.47 42.3,51.25 U$1.M2IN2
M2IN2_DRV2
  Top 0.61: U$6.M2IN2 60.55,31.5 | 60.55,31.5 60.55,34.29 61.82,35.56 82.14,35.56 83.99,33.71 94.26,33.71 POWER2.5 | 60.55,31.5 | 60.55,31.5 | 60.55,31.5 60.96,30.69 | 60.55,31.5 60.14,30.69 | 60.14,30.69 | U$6.M2IN2 60.14,30.69 | 60.55,31.5 60.96,30.69 | U$6.M2IN2 60.96,30.69 | 60.55,31.5 60.14,30.69 | U$6.M2IN2 60.14,30.69 | 60.55,31.5 60.96,30.69 | U$6.M2IN2 60.96,30.69
SF_DRV1
  Bottom 0.61: U$1.M2SF 32.61,54.61 33.88,55.88 50.99,55.88 U$1.M1SF 59.88,46.99 74.52,46.99 85.19,57.66 88.04,57.66 92.71,62.33 95.5,62.33 POWER1.2
SF_DRV2
  Bottom 0.61: U$6.M1SF 47.85,25.4 51.66,22.86 69.44,22.86 70.71,24.13 U$6.M2SF 73.25,33.02 78.33,33.02 84.93,26.42 98.14,26.42 100.17,28.45 100.17,32.16 98.3,34.04 POWER2.6
V_MONITOR
  Top 1.016: R6_180K.P$1 100.94,71.17 R4_15K.P$2 100.94,56.13 97.89,53.09 POWER1.8
(copper drawn outside any net)
  shapes: Top area x2

### Text on the board
tPlace: DRV1 | 3V3_Reg | M2O2 | M2O1 | M1O2 | M1O1 | 180k_R | 3V3 Reg / D36V6F3 | 12V Reg / D30V30F12 | 12V_Reg1 | SHDN | Pololu / Item # / 3791 | 15k_R | 3V3_OUT | Pololu Item # 1213 | DRV1_IN | Pololu / Item / # 4896 | M1IN2 | PG_1 | MC33926 Motor Driver Carrier | POWER 1 | M1IN1 | SF_DRV1 | 12V_OUT | M2IN2 | GND | 12V_EN | M2IN1 | V_Monitor | Input_3V_Feather | 5V_OUT_1 | GND | - | - | DRV2_IN | POWER 2 | VIN_21V | M1IN2 | 3V3_OUT | + | + | M1IN1 | 5V_OUT_2 | M2IN2 | M2IN1 | 12V_EN | SF_DRV2 | 12V_OUT | PG_2 | SHDN | MC33926 Motor Driver Carrier | 5V_Out | GND/OFF | ON | Pololu / Item / # 4896 | Pololu Item # 1213 | 3V3/5_Switch | 5V Reg / D36V6F3 | 12V Reg / D30V30F12 | 12V_Reg2 | 5V_Reg | Pololu / Item # / 3792 | Design by: Alex Trevino / / Contact: / alexratred@gmail.com | GND/OFF | ON | M1O1 | M1O2 | M2O1 | M2O2 | DRV2 | Power PCB / / S25-18 | 12V_Switch | Two 12 V, one 3V, one 5V converters / Two Motor Drivers, two IDC headers, / two switches, voltage divider resistors (15k and 180k) / and XT60PW-M connector for 21 V input